# Altium schematic sheet Top Level Sheet.SchDoc
size A4; SheetNumber: 1; SheetTotal: 7
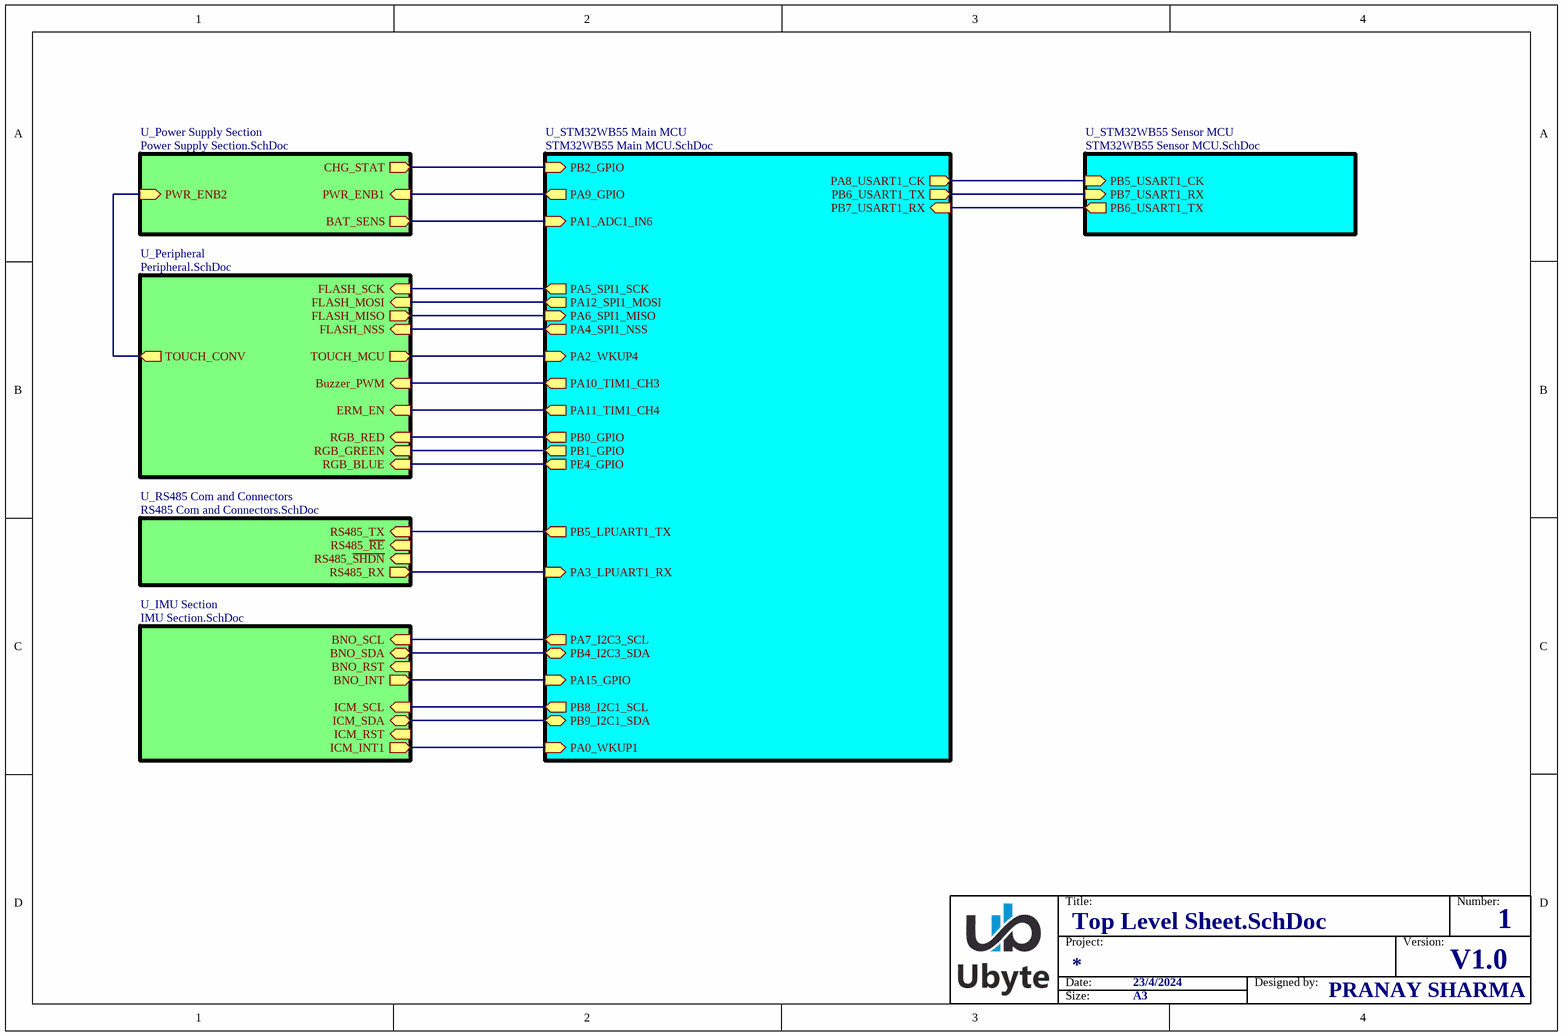
[diagram p0: Top Level Sheet.SchDoc]

## Sub-sheets
U_IMU Section = IMU Section.SchDoc: BNO_INT (out), BNO_SCL (in), BNO_SDA (bidir), BNO_RST (in), ICM_INT1 (out), ICM_SCL (in), ICM_SDA (bidir), ICM_RST (in)
U_Peripheral = Peripheral.SchDoc: FLASH_MISO (out), TOUCH_MCU (out), TOUCH_CONV (out), FLASH_SCK (in), FLASH_MOSI (in), FLASH_NSS (in), Buzzer_PWM (in), ERM_EN (in), RGB_RED (in), RGB_GREEN (in), RGB_BLUE (in)
U_Power Supply Section = Power Supply Section.SchDoc: CHG_STAT (out), BAT_SENS (out), PWR_ENB1 (in), PWR_ENB2 (in)
U_RS485 Com and Connectors = RS485 Com and Connectors.SchDoc: RS485_~{RE} (in), RS485_RX (out), RS485_TX (in), RS485_~{SHDN} (in)
U_STM32WB55 Main MCU = STM32WB55 Main MCU.SchDoc: PA0_WKUP1 (in), PA1_ADC1_IN6 (in), PA2_WKUP4 (in), PA3_LPUART1_RX (in), PA7_I2C3_SCL (out), PA9_GPIO (out), PB2_GPIO (in), PA10_TIM1_CH3 (out), PA11_TIM1_CH4 (out), PA15_GPIO (in), PB4_I2C3_SDA (bidir), PB5_LPUART1_TX (out), PA4_SPI1_NSS (out), PA5_SPI1_SCK (out), PA6_SPI1_MISO (in), PA12_SPI1_MOSI (out), PB8_I2C1_SCL (out), PB9_I2C1_SDA (bidir), PB0_GPIO (out), PB1_GPIO (out), PE4_GPIO (out), PA8_USART1_CK (out), PB6_USART1_TX (out), PB7_USART1_RX (in)
U_STM32WB55 Sensor MCU = STM32WB55 Sensor MCU.SchDoc: PB6_USART1_TX (out), PB7_USART1_RX (in), PB5_USART1_CK (in)

## Nets
(unnamed): sheet U_Power Supply Section/CHG_STAT, sheet U_STM32WB55 Main MCU/PB2_GPIO
(unnamed): sheet U_Power Supply Section/BAT_SENS, sheet U_STM32WB55 Main MCU/PA1_ADC1_IN6
(unnamed): sheet U_Power Supply Section/PWR_ENB1, sheet U_STM32WB55 Main MCU/PA9_GPIO
(unnamed): sheet U_Power Supply Section/PWR_ENB2, sheet U_Peripheral/TOUCH_CONV
(unnamed): sheet U_RS485 Com and Connectors/RS485_RX, sheet U_STM32WB55 Main MCU/PA3_LPUART1_RX
(unnamed): sheet U_RS485 Com and Connectors/RS485_TX, sheet U_STM32WB55 Main MCU/PB5_LPUART1_TX
(unnamed): sheet U_IMU Section/BNO_INT, sheet U_STM32WB55 Main MCU/PA15_GPIO
(unnamed): sheet U_IMU Section/BNO_SCL, sheet U_STM32WB55 Main MCU/PA7_I2C3_SCL
(unnamed): sheet U_IMU Section/BNO_SDA, sheet U_STM32WB55 Main MCU/PB4_I2C3_SDA
(unnamed): sheet U_IMU Section/ICM_INT1, sheet U_STM32WB55 Main MCU/PA0_WKUP1
(unnamed): sheet U_IMU Section/ICM_SCL, sheet U_STM32WB55 Main MCU/PB8_I2C1_SCL
(unnamed): sheet U_IMU Section/ICM_SDA, sheet U_STM32WB55 Main MCU/PB9_I2C1_SDA
(unnamed): sheet U_Peripheral/FLASH_MISO, sheet U_STM32WB55 Main MCU/PA6_SPI1_MISO
(unnamed): sheet U_Peripheral/TOUCH_MCU, sheet U_STM32WB55 Main MCU/PA2_WKUP4
(unnamed): sheet U_Peripheral/FLASH_SCK, sheet U_STM32WB55 Main MCU/PA5_SPI1_SCK
(unnamed): sheet U_Peripheral/FLASH_MOSI, sheet U_STM32WB55 Main MCU/PA12_SPI1_MOSI
(unnamed): sheet U_Peripheral/FLASH_NSS, sheet U_STM32WB55 Main MCU/PA4_SPI1_NSS
(unnamed): sheet U_Peripheral/Buzzer_PWM, sheet U_STM32WB55 Main MCU/PA10_TIM1_CH3
(unnamed): sheet U_Peripheral/ERM_EN, sheet U_STM32WB55 Main MCU/PA11_TIM1_CH4
(unnamed): sheet U_Peripheral/RGB_RED, sheet U_STM32WB55 Main MCU/PB0_GPIO
(unnamed): sheet U_Peripheral/RGB_GREEN, sheet U_STM32WB55 Main MCU/PB1_GPIO
(unnamed): sheet U_Peripheral/RGB_BLUE, sheet U_STM32WB55 Main MCU/PE4_GPIO
(unnamed): sheet U_STM32WB55 Main MCU/PA8_USART1_CK, sheet U_STM32WB55 Sensor MCU/PB5_USART1_CK
(unnamed): sheet U_STM32WB55 Main MCU/PB6_USART1_TX, sheet U_STM32WB55 Sensor MCU/PB7_USART1_RX
(unnamed): sheet U_STM32WB55 Main MCU/PB7_USART1_RX, sheet U_STM32WB55 Sensor MCU/PB6_USART1_TX

## Notes on the sheet
- Title:
- Number:
- Date:
- Project:
- 23/4/2024
- Designed by:
- Version:
- V1.0
- Size:
- A3
- PRANAY SHARMA